# Altium schematic sheet Block_Diagram.SchDoc
size A4; SheetNumber: 1; SheetTotal: 2
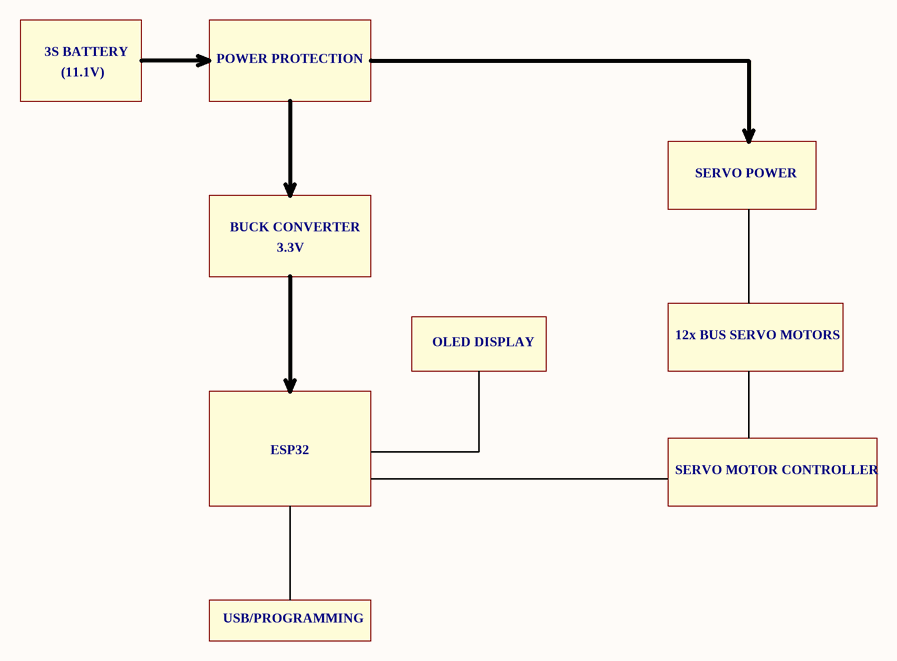
[diagram p0: Block_Diagram.SchDoc]

## Notes on the sheet
- 3S BATTERY
- (11.1V)
- POWER PROTECTION
- SERVO POWER
- BUCK CONVERTER
- 3.3V
- OLED DISPLAY
- 12x BUS SERVO MOTORS
- ESP32
- SERVO MOTOR CONTROLLER
- USB/PROGRAMMING